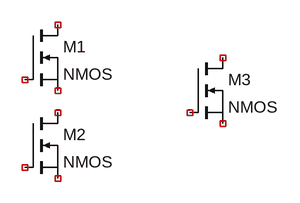
[diagram p0: schematic Draft5.asc]
Draft5.asc, the LTspice schematic file:
Version 4
SHEET 1 880 680
SYMBOL nmos 112 80 R0
SYMATTR InstName M1
SYMBOL nmos 112 208 R0
SYMATTR InstName M2
SYMBOL nmos 352 128 R0
SYMATTR InstName M3

The netlist it stands for:
* Draft5.asc
M1 NC_01 NC_02 NC_03 NC_03 NMOS
M2 NC_04 NC_05 NC_06 NC_06 NMOS
M3 NC_07 NC_08 NC_09 NC_09 NMOS
.model NMOS NMOS
.model PMOS PMOS
.lib standard.mos
.backanno
.end